# EasyEDA schematic SCH_climber-dog_2024-09-03.json
TITLE: Sheet_1; REV: 1.0; Date: 2024-09-03; Sheet: 1/1; Drawn By: erich27230; Company: Your Company
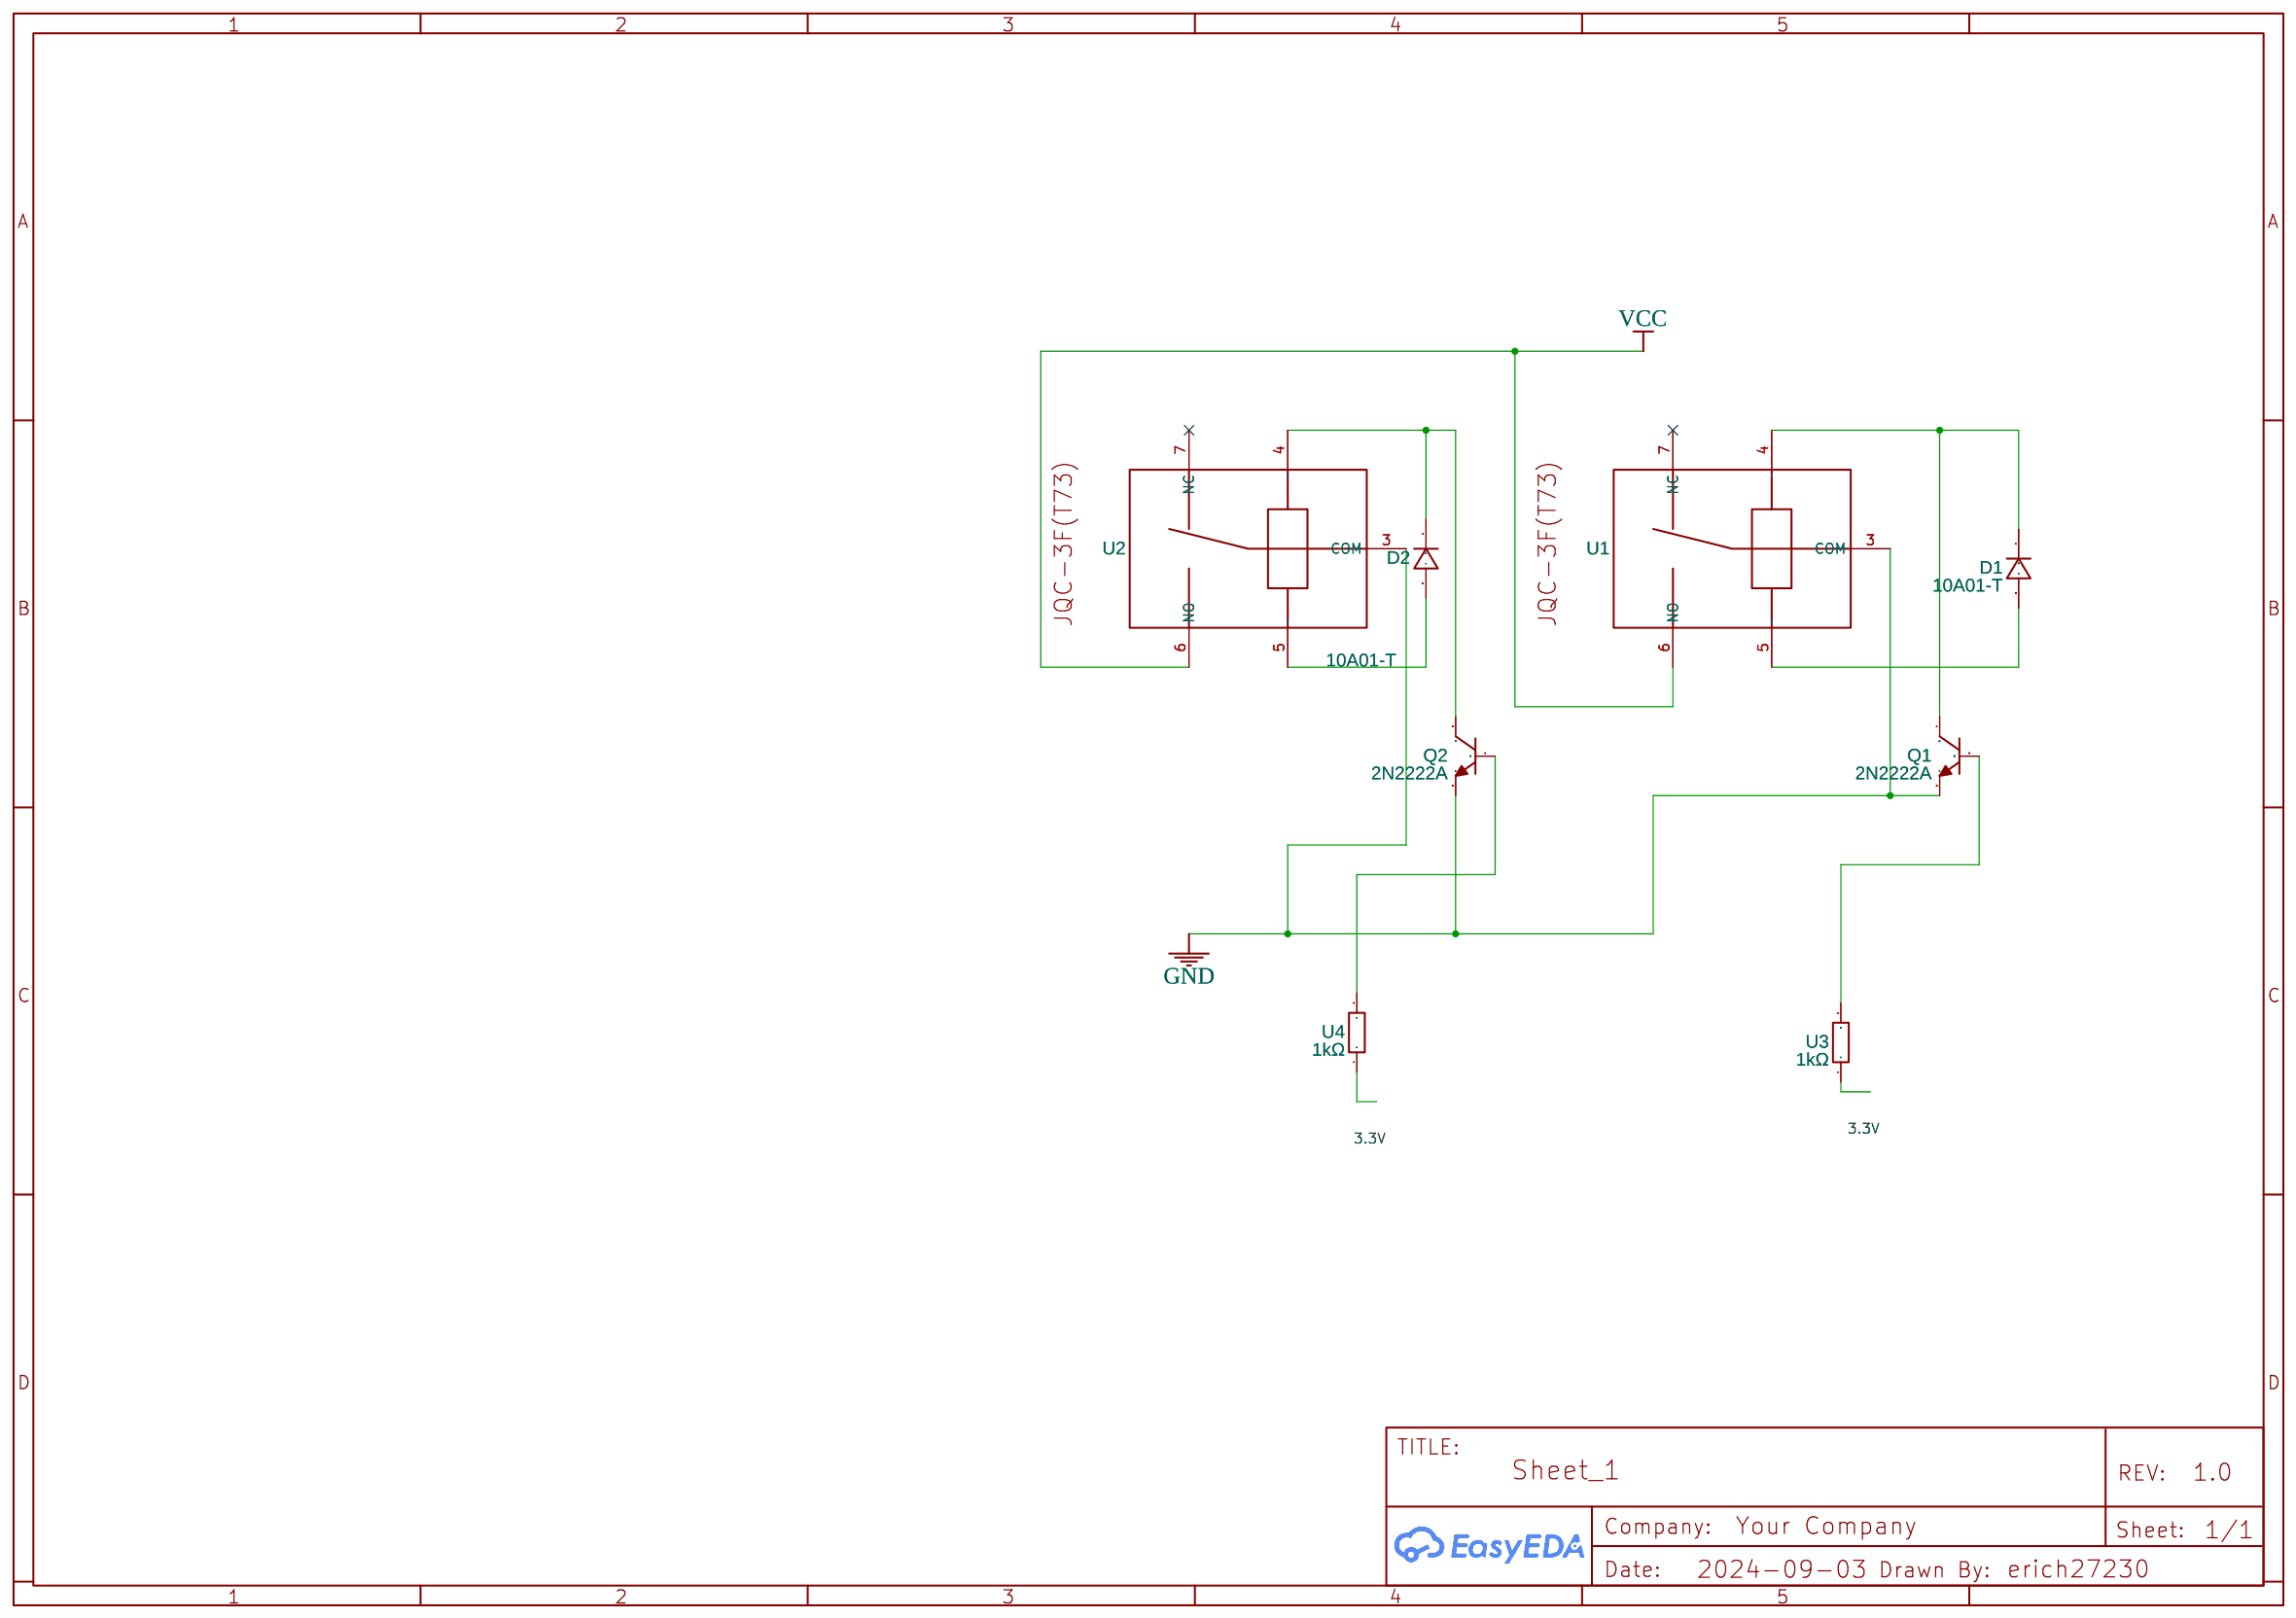
[diagram p0: schematic sheet]

## Parts
D1  10A01-T  [R-6_BD8.9-L8.9-P12.90-D1.3-RD]
D2  10A01-T  [R-6_BD8.9-L8.9-P12.90-D1.3-RD]
Q1  2N2222A  [TO-92-3_L4.8-W3.7-P2.54-R]
Q2  2N2222A  [TO-92-3_L4.8-W3.7-P2.54-R]
U1  JQC-3F(T73) COPY  [JQC-3F(T73)]
U2  JQC-3F(T73) COPY  [JQC-3F(T73)]
U3  1kΩ  [R0402]
U4  1kΩ  [R0402]

## Library data of the parts
D1 D2 = 10A01-T: Contributor: LCSC; Supplier Part: C151346; Supplier: LCSC; Manufacturer: DIODES(美台); JLCPCB Part Class: Extended Part
Q1 Q2 = 2N2222A: Contributor: LCSC; Supplier: LCSC; Supplier Part: C358533; Manufacturer: BLUE ROCKET(蓝箭); JLCPCB Part Class: Extended Part
U1 U2 = JQC-3F(T73) COPY: Contributor: Guest
U3 U4 = 0402 ±5% 1K: Contributor: lcsc; Supplier: LCSC; Supplier Part: C2889347; Manufacturer: VO(翔胜); JLCPCB Part Class: Extended Part

## Nets
GND: Q1.3(E) Q2.3(E) U1.3(COM) U2.3(COM)
VCC: U1.6(NO) U2.6(NO)
Net-(D1-1): D1.1(C) Q1.1(C) U1.4(COIL)
Net-(D1-2): D1.2(A) U1.5(COIL)
Net-(D2-1): D2.1(C) Q2.1(C) U2.4(COIL)
Net-(D2-2): D2.2(A) U2.5(COIL)
Net-(Q1-2): Q1.2(B) U3.2
Net-(Q2-2): Q2.2(B) U4.2

Not connected (* = marked no-connect by the designer): U1 7(NC)*; U2 7(NC)*; U3 1; U4 1
